# Altium project head 2.0.0.PrjPcb
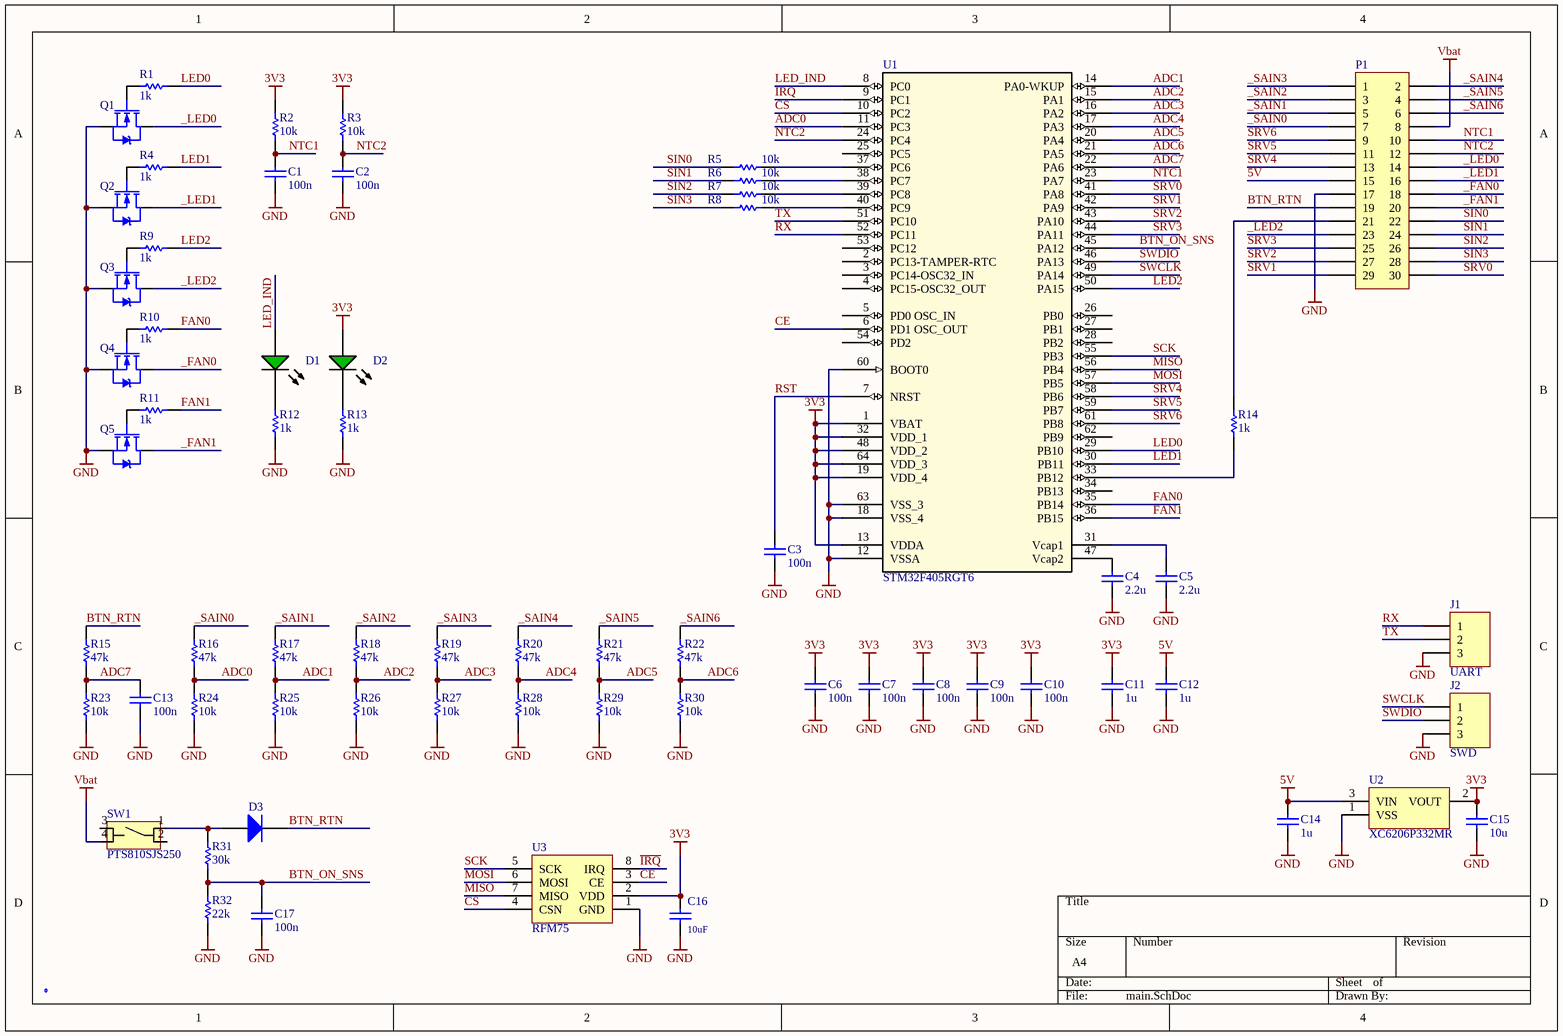
[diagram p0: main.SchDoc]
PRJ_ID: FS Head; PRJ_VER: 2.0.0
1 sheet, 65 parts. Net scope: global (net labels, ports and power ports of the same name join across sheets).
Board file: pcb.PcbDoc

## Sheet main.SchDoc
size A4

### Parts
C1  100n  [C0603]
C2  100n  [C0603]
C3  100n  [C0402]
C4  2.2u  [C0603]
C5  2.2u  [C0603]
C6  100n  [C0402]
C7  100n  [C0402]
C8  100n  [C0402]
C9  100n  [C0402]
C10  100n  [C0402]
C11  1u  [C0603]
C12  1u  [C0603]
C13  100n  [C0402]
C14  1u  [C1210]
C15  10u  [C1210]
C16  10uF  [C0805]
C17  100n  [C0402]
D1  GRN  [LED-0603-GRN]  (value not drawn)
D2  GRN  [LED-0603-GRN]  (value not drawn)
D3  DS1M  [SOD-123FL]  (value not drawn)
J1  UART  [HDR-1x3-P1.25]  (no BOM)
J2  SWD  [HDR-1x3-P1.25]  (no BOM)
LOGO1  LOGO  [LOGO]  (value not drawn)  (no BOM)
P1  Header 15X2  [HDR2X15-2mm]  (value not drawn)
Q1  IRLML2502  [SOT-23]  (value not drawn)
Q2  IRLML2502  [SOT-23]  (value not drawn)
Q3  IRLML2502  [SOT-23]  (value not drawn)
Q4  IRLML2502  [SOT-23]  (value not drawn)
Q5  IRLML2502  [SOT-23]  (value not drawn)
R1  1k  [R0603]
R2  10k  [R0603]
R3  10k  [R0603]
R4  1k  [R0603]
R5  10k  [R0603]
R6  10k  [R0603]
R7  10k  [R0603]
R8  10k  [R0603]
R9  1k  [R0603]
R10  1k  [R0603]
R11  1k  [R0603]
R12  1k  [R0603]
R13  1k  [R0603]
R14  1k  [R0603]
R15  47k  [R0603]
R16  47k  [R0402]
R17  47k  [R0402]
R18  47k  [R0402]
R19  47k  [R0402]
R20  47k  [R0402]
R21  47k  [R0603]
R22  47k  [R0603]
R23  10k  [R0603]
R24  10k  [R0402]
R25  10k  [R0402]
R26  10k  [R0402]
R27  10k  [R0402]
R28  10k  [R0402]
R29  10k  [R0603]
R30  10k  [R0603]
R31  30k  [R0603]
R32  22k  [R0603]
SW1  PTS810SJS250  [BTN_PTS810]
U1  STM32F405RGT6  [LQFP-64]
U2  XC6206P332MR  [SOT-23]
U3  RFM75  [RFM75]

### Nets
3V3: C6.2 C7.2 C8.2 C9.2 C10.2 C11.2 C15.2 C16.2 D2.1(A) R2.2 R3.2 U1.1(VBAT) U1.13(VDDA) U1.19(VDD_4) U1.32(VDD_1) U1.48(VDD_2) U1.64(VDD_3) U2.2(VOUT) U3.2(VDD)
5V: C12.2 C14.2 P1.15 U2.3(VIN)
GND: C1.1 C2.1 C3.1 C4.1 C5.1 C6.1 C7.1 C8.1 C9.1 C10.1 C11.1 C12.1 C13.1 C14.1 C15.1 C16.1 C17.1 J1.3 J2.3 P1.17 Q1.2(S) Q2.2(S) Q3.2(S) Q4.2(S) Q5.2(S) R12.1 R13.1 R23.1 R24.1 R25.1 R26.1 R27.1 R28.1 R29.1 R30.1 R32.1 U1.12(VSSA) U1.18(VSS_4) U1.60(BOOT0) U1.63(VSS_3) U2.1(VSS) U3.1(GND)
Vbat: P1.8 SW1.4
_FAN0: P1.18 Q4.3(D)
_FAN1: P1.20 Q5.3(D)
_LED0: P1.14 Q1.3(D)
_LED1: P1.16 Q2.3(D)
_LED2: P1.23 Q3.3(D)
_SAIN0: P1.7 R16.2
_SAIN1: P1.5 R17.2
_SAIN2: P1.3 R18.2
_SAIN3: P1.1 R19.2
_SAIN4: P1.2 R20.2
_SAIN5: P1.4 R21.2
_SAIN6: P1.6 R22.2
ADC0: R16.1 R24.2 U1.11(PC3)
ADC1: R17.1 R25.2 U1.14(PA0-WKUP)
ADC2: R18.1 R26.2 U1.15(PA1)
ADC3: R19.1 R27.2 U1.16(PA2)
ADC4: R20.1 R28.2 U1.17(PA3)
ADC5: R21.1 R29.2 U1.20(PA4)
ADC6: R22.1 R30.2 U1.21(PA5)
ADC7: C13.2 R15.1 R23.2 U1.22(PA6)
BTN_ON_SNS: C17.2 R31.1 R32.2 U1.45(PA12)
BTN_RTN: D3.2(K) P1.19 R15.2
~{CS}: U1.10(PC2) U3.4(CSN)
CE: U1.6(PD1_OSC_OUT) U3.3(CE)
FAN0: R10.2 U1.35(PB14)
FAN1: R11.2 U1.36(PB15)
~{IRQ}: U1.9(PC1) U3.8(IRQ)
LED0: R1.2 U1.29(PB10)
LED1: R4.2 U1.30(PB11)
LED2: R9.2 U1.50(PA15)
LED_IND: D1.1(A) U1.8(PC0)
MISO: U1.56(PB4) U3.7(MISO)
MOSI: U1.57(PB5) U3.6(MOSI)
NTC1: C1.2 P1.10 R2.1 U1.23(PA7)
NTC2: C2.2 P1.12 R3.1 U1.24(PC4)
RST: C3.2 U1.7(NRST)
RX: J1.1 U1.52(PC11)
SCK: U1.55(PB3) U3.5(SCK)
SIN0: P1.22 R5.2
SIN1: P1.24 R6.2
SIN2: P1.26 R7.2
SIN3: P1.28 R8.2
SRV0: P1.30 U1.41(PA8)
SRV1: P1.29 U1.42(PA9)
SRV2: P1.27 U1.43(PA10)
SRV3: P1.25 U1.44(PA11)
SRV4: P1.13 U1.58(PB6)
SRV5: P1.11 U1.59(PB7)
SRV6: P1.9 U1.61(PB8)
SWCLK: J2.1 U1.49(PA14)
SWDIO: J2.2 U1.46(PA13)
TX: J1.2 U1.51(PC10)
NetC4_2: C4.2 U1.47(Vcap2)
NetC5_2: C5.2 U1.31(Vcap1)
NetD1_2: D1.2(K) R12.2
NetD2_2: D2.2(K) R13.2
NetD3_1: D3.1(A) R31.2 SW1.1
NetP1_21: P1.21 R14.2
NetQ1_1: Q1.1(G) R1.1
NetQ2_1: Q2.1(G) R4.1
NetQ3_1: Q3.1(G) R9.1
NetQ4_1: Q4.1(G) R10.1
NetQ5_1: Q5.1(G) R11.1
NetR5_1: R5.1 U1.37(PC6)
NetR6_1: R6.1 U1.38(PC7)
NetR7_1: R7.1 U1.39(PC8)
NetR8_1: R8.1 U1.40(PC9)
NetR14_1: R14.1 U1.33(PB12)

Not connected (* = marked no-connect by the designer): SW1 2 3; U1 2(PC13-TAMPER-RTC) 3(PC14-OSC32_IN) 4(PC15-OSC32_OUT) 5(PD0_OSC_IN) 25(PC5) 26(PB0) 27(PB1) 28(PB2) 34(PB13) 53(PC12) 54(PD2) 62(PB9)

### Library data of the parts
C1-C15 C17 = Cap
C16 = CAP
D1 D2 = LED-0603-GREEN: LED 0603 GRN; P/N: SZYY0603G; LCSC part number: C434420
D3 = US1M-13-F
J1 J2 = Header 3
P1 = Header 15X2: Header, 15-Pin, Dual row
Q1-Q5 = IRLML2502: MOSFET N-CH 20V 4.2A SOT-23-3
R1-R32 = Res1
SW1 = Component_1: P/N: PTS810SJK250SMTRLFS; LCSC part number: C221896
U1 = STM32F405RGT6: MCU STM32F405RGT6; P/N: STM32F405RGT6
U2 = Component_4_1: LCSC part number: C347376; P/N: XC6206P332MR